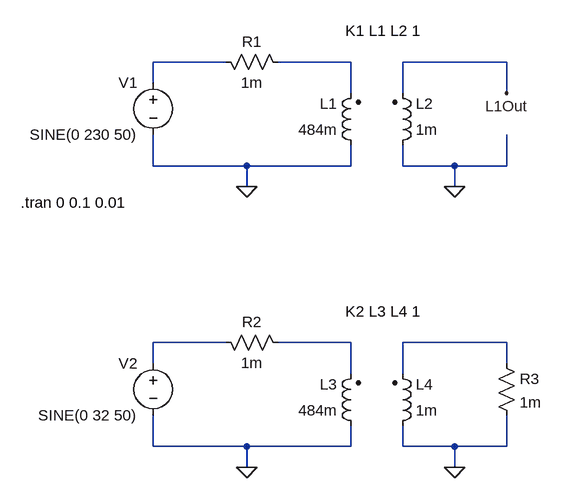
[diagram p0: schematic gekoppelteInduktivitaeten.asc]
gekoppelteInduktivitaeten.asc, the LTspice schematic file:
Version 4
SHEET 1 880 776
WIRE 176 112 64 112
WIRE 368 112 256 112
WIRE 608 112 448 112
WIRE 64 144 64 112
WIRE 368 160 368 112
WIRE 448 160 448 112
WIRE 608 160 608 112
WIRE 64 272 64 224
WIRE 208 272 64 272
WIRE 368 272 368 240
WIRE 368 272 208 272
WIRE 448 272 448 240
WIRE 528 272 448 272
WIRE 608 272 608 224
WIRE 608 272 528 272
WIRE 208 304 208 272
WIRE 528 304 528 272
WIRE 176 544 64 544
WIRE 368 544 256 544
WIRE 608 544 448 544
WIRE 64 576 64 544
WIRE 608 576 608 544
WIRE 368 592 368 544
WIRE 448 592 448 544
WIRE 64 704 64 656
WIRE 208 704 64 704
WIRE 368 704 368 672
WIRE 368 704 208 704
WIRE 448 704 448 672
WIRE 528 704 448 704
WIRE 608 704 608 656
WIRE 608 704 528 704
WIRE 208 736 208 704
WIRE 528 736 528 704
FLAG 208 304 0
FLAG 528 304 0
FLAG 608 160 L1Out
FLAG 208 736 0
FLAG 528 736 0
SYMBOL voltage 64 128 M0
WINDOW 123 0 0 Left 0
WINDOW 39 0 0 Left 0
SYMATTR InstName V1
SYMATTR Value SINE(0 230 50)
SYMBOL ind2 384 256 R180
WINDOW 0 36 80 Left 2
WINDOW 3 36 40 Left 2
SYMATTR InstName L1
SYMATTR Value 484m
SYMATTR Type ind
SYMBOL ind2 432 256 M180
WINDOW 0 36 80 Left 2
WINDOW 3 36 40 Left 2
SYMATTR InstName L2
SYMATTR Value 1m
SYMATTR Type ind
SYMBOL res 160 96 M90
WINDOW 0 0 56 VBottom 2
WINDOW 3 32 56 VTop 2
SYMATTR InstName R1
SYMATTR Value 1m
SYMBOL voltage 64 560 M0
WINDOW 123 0 0 Left 0
WINDOW 39 0 0 Left 0
SYMATTR InstName V2
SYMATTR Value SINE(0 32 50)
SYMBOL ind2 384 688 R180
WINDOW 0 36 80 Left 2
WINDOW 3 36 40 Left 2
SYMATTR InstName L3
SYMATTR Value 484m
SYMATTR Type ind
SYMBOL ind2 432 688 M180
WINDOW 0 36 80 Left 2
WINDOW 3 36 40 Left 2
SYMATTR InstName L4
SYMATTR Value 1m
SYMATTR Type ind
SYMBOL res 160 528 M90
WINDOW 0 0 56 VBottom 2
WINDOW 3 32 56 VTop 2
SYMATTR InstName R2
SYMATTR Value 1m
SYMBOL res 592 560 R0
SYMATTR InstName R3
SYMATTR Value 1m
TEXT -140 328 Left 2 !.tran 0 0.1 0.01
TEXT 360 64 Left 2 !K1 L1 L2 1
TEXT 360 496 Left 2 !K2 L3 L4 1

The netlist it stands for:
* gekoppelteInduktivitaeten.asc
V1 N001 0 SINE(0 230 50)
L1 0 N002 484m
L2 0 L1Out 1m
R1 N001 N002 1m
V2 N003 0 SINE(0 32 50)
L3 0 N004 484m
L4 0 N005 1m
R2 N003 N004 1m
R3 N005 0 1m
.tran 0 0.1 0.01
K1 L1 L2 1
K2 L3 L4 1
.backanno
.end